# Altium schematic sheet KS-WL-GW-MCU.SchDoc
size A3; CheckedBy: Fanmingjie; Author: Jason Huang; DrawnBy: Chen Minjie; Address1: Buliding 5, No.1528,; Address2: Gu Mei Rd HQ6,; Address3: Shanghai, China; Address4: 200233; Revision: 0.1; SheetNumber: 1; SheetTotal: 1; DocumentName: NGHA SCC V0.1; ProjectName: NGHA
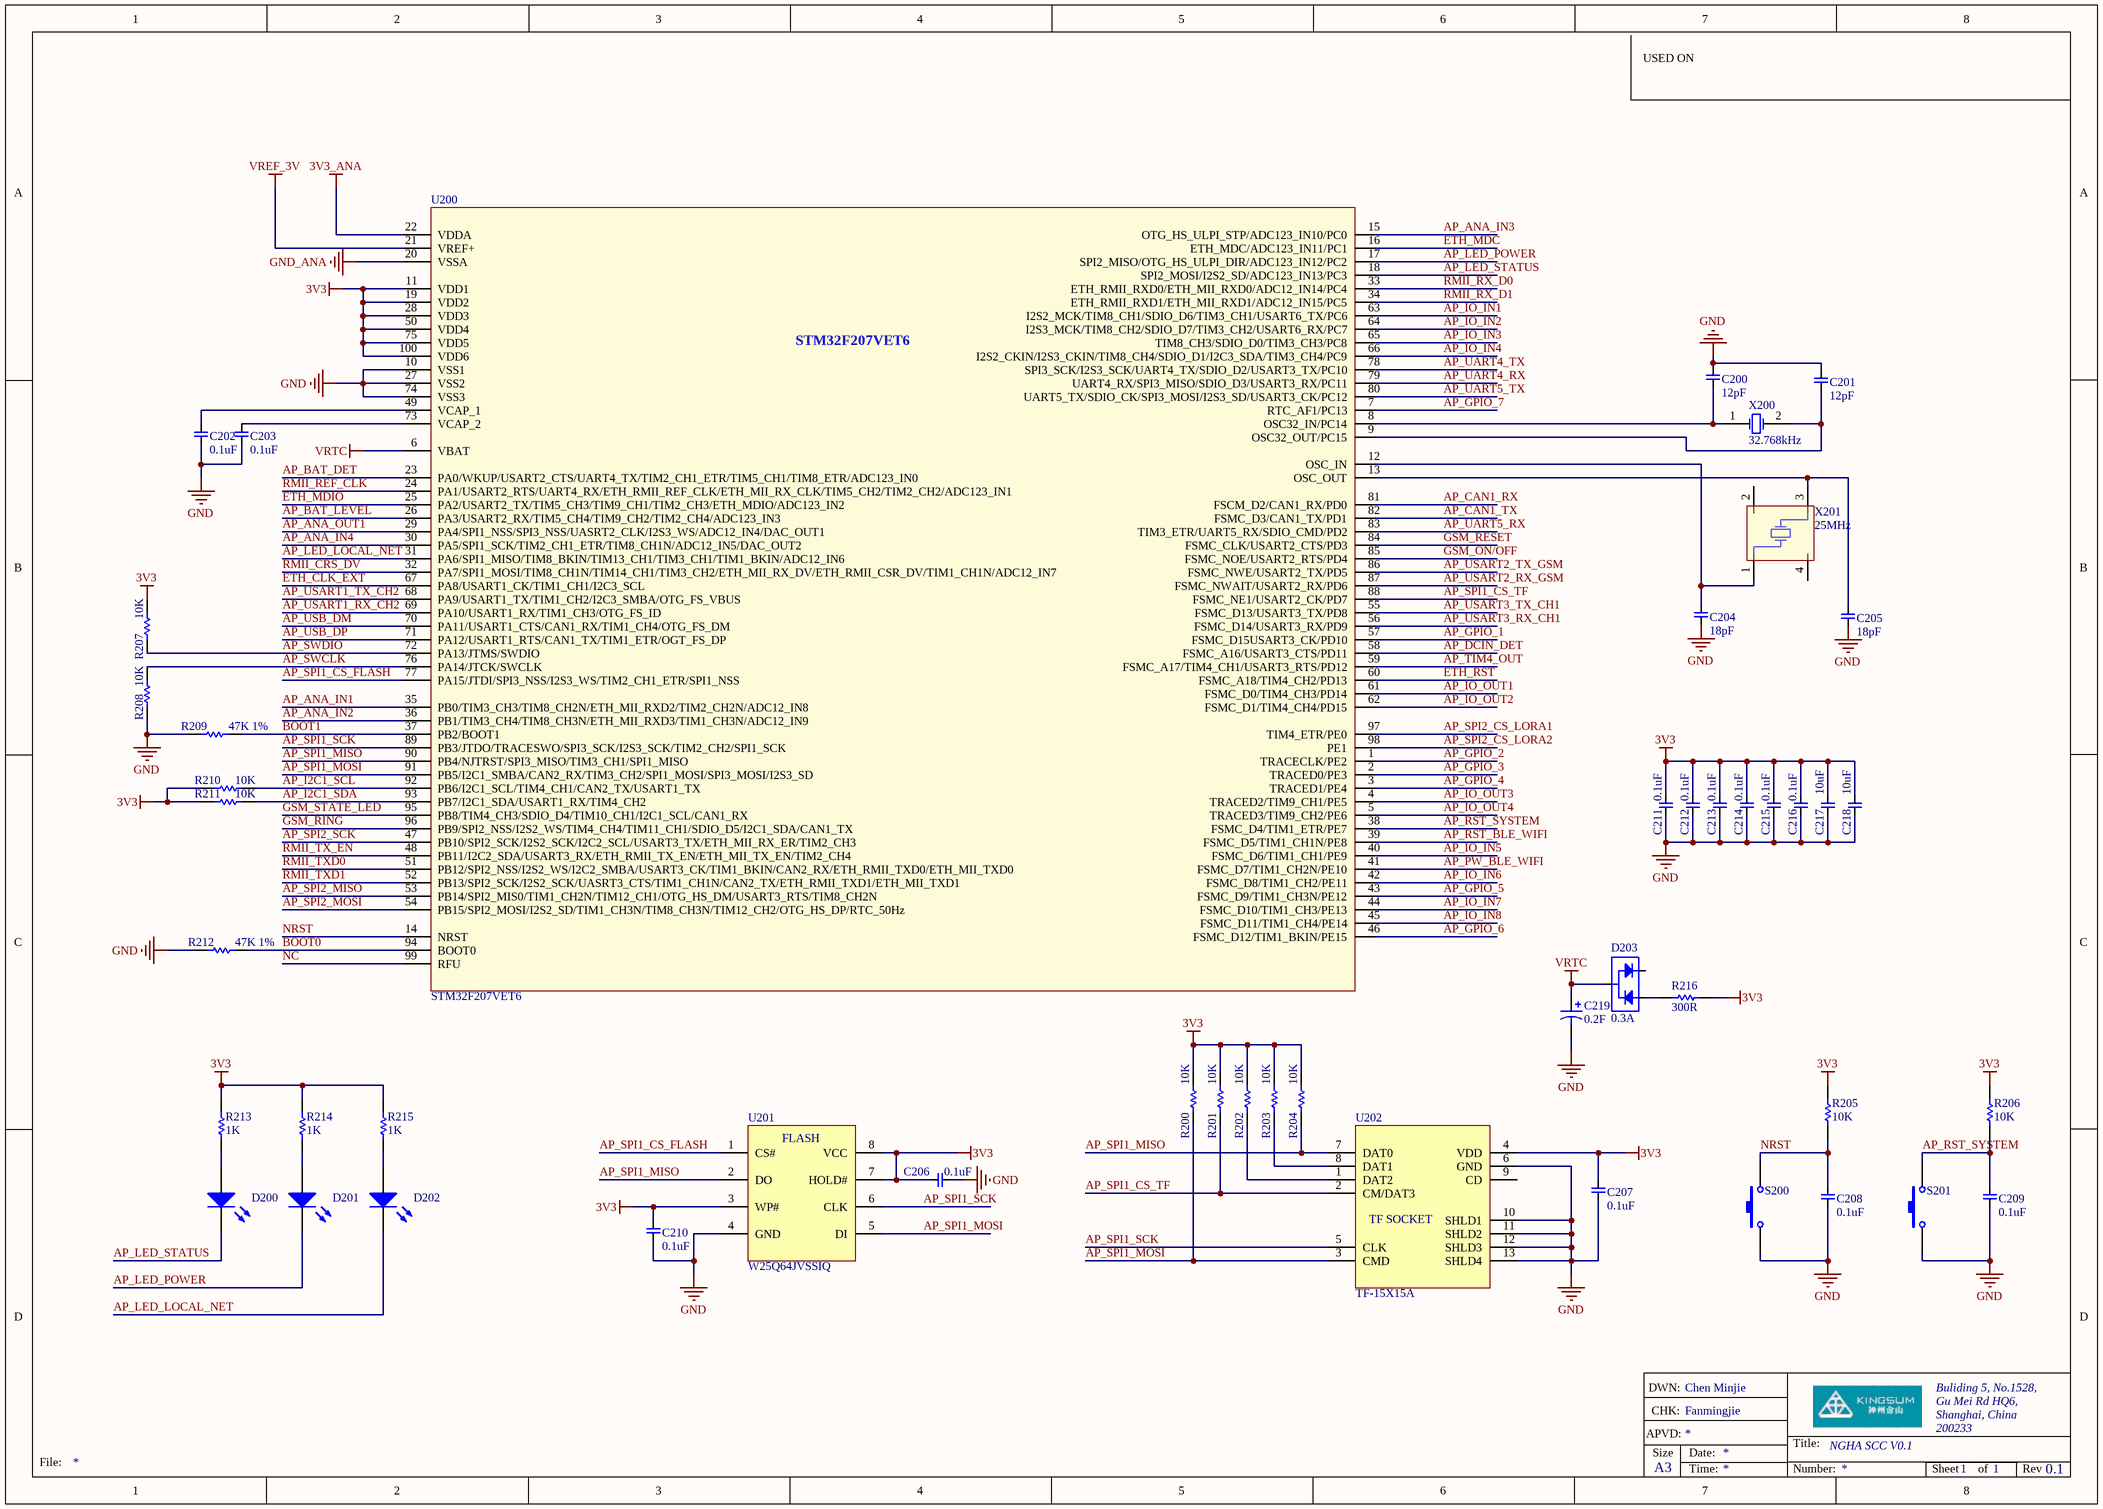
[diagram p0: KS-WL-GW-MCU.SchDoc]

## Parts
C200  12pF  [0402 CAP]
C201  12pF  [0402 CAP]
C202  0.1uF  [0402 CAP]
C203  0.1uF  [0402 CAP]
C204  18pF  [0402 CAP]
C205  18pF  [0402 CAP]
C206  0.1uF  [0402 CAP]
C207  0.1uF  [0402 CAP]
C208  0.1uF  [0402 CAP]
C209  0.1uF  [0402 CAP]
C210  0.1uF  [0402 CAP]
C211  0.1uF  [0402 CAP]
C212  0.1uF  [0402 CAP]
C213  0.1uF  [0402 CAP]
C214  0.1uF  [0402 CAP]
C215  0.1uF  [0402 CAP]
C216  0.1uF  [0402 CAP]
C217  10uF  [C1206_L]
C218  10uF  [C1206_L]
C219  0.2F  [RTC Cap]
D200  GRN  [led 257]  (value not drawn)
D201  GRN  [led 257]  (value not drawn)
D202  GRN  [led 257]  (value not drawn)
D203  0.3A  [SOT-23-3]
R200  10K  [0402 Res]
R201  10K  [0402 Res]
R202  10K  [0402 Res]
R203  10K  [0402 Res]
R204  10K  [0402 Res]
R205  10K  [0402 Res]
R206  10K  [0402 Res]
R207  10K  [0402 Res]
R208  10K  [0402 Res]
R209  47K 1%  [0402 Res]
R210  10K  [0402 Res]
R211  10K  [0402 Res]
R212  47K 1%  [0402 Res]
R213  1K  [0402 Res]
R214  1K  [0402 Res]
R215  1K  [0402 Res]
R216  300R  [0402 Res]
S200  ADE-SW-Button 6X6  [Switch P4 6X6]  (value not drawn)
S201  Kingsum-SW-Button 668  [SW 6X6X8]  (value not drawn)
U200  STM32F207VET6  [LQFP100]
U201  W25Q64JVSSIQ  [SOICW-8]
U202  TF-15X15A  [TF Socket SOFUNG]
X200  32.768kHz  [XTAL]
X201  25MHz  [XTAL_4 - 25X20]

## Nets
3V3: C206.2 C207.1 C210.2 C211.2 C212.2 C213.2 C214.2 C215.2 C216.2 C217.2 C218.2 R200.2 R201.2 R202.2 R203.2 R204.2 R205.2 R206.2 R207.2 R210.1 R211.1 R213.2 R214.2 R215.2 R216.2 U200.11(VDD1) U200.19(VDD2) U200.28(VDD3) U200.50(VDD4) U200.75(VDD5) U200.100(VDD6) U201.3(WP#) U201.7(HOLD#) U201.8(VCC) U202.4(VDD)
3V3_ANA: U200.22(VDDA)
GND: C200.2 C201.2 C202.1 C203.1 C204.1 C205.1 C206.1 C207.2 C208.1 C209.1 C210.1 C211.1 C212.1 C213.1 C214.1 C215.1 C216.1 C217.1 C218.1 C219.2 R208.1 R209.2 R212.2 S200.1 S201.1 U200.10(VSS1) U200.27(VSS2) U200.74(VSS3) U201.4(GND) U202.6(GND) U202.10(SHLD1) U202.11(SHLD2) U202.12(SHLD3) U202.13(SHLD4)
GND_ANA: U200.20(VSSA)
VREF_3V: U200.21(VREF+)
VRTC: C219.1 D203.3 U200.6(VBAT)
AP_ANA_IN1: U200.35(PB0/TIM3_CH3/TIM8_CH2N/ETH_MII_RXD2/TIM2_CH2N/ADC12_IN8)
AP_ANA_IN2: U200.36(PB1/TIM3_CH4/TIM8_CH3N/ETH_MII_RXD3/TIM1_CH3N/ADC12_IN9)
AP_ANA_IN3: U200.15(OTG_HS_ULPI_STP/ADC123_IN10/PC0)
AP_ANA_IN4: U200.30(PA5/SPI1_SCK/TIM2_CH1_ETR/TIM8_CH1N/ADC12_IN5/DAC_OUT2)
AP_ANA_OUT1: U200.29(PA4/SPI1_NSS/SPI3_NSS/UASRT2_CLK/I2S3_WS/ADC12_IN4/DAC_OUT1)
AP_BAT_DET: U200.23(PA0/WKUP/USART2_CTS/UART4_TX/TIM2_CH1_ETR/TIM5_CH1/TIM8_ETR/ADC123_IN0)
AP_BAT_LEVEL: U200.26(PA3/USART2_RX/TIM5_CH4/TIM9_CH2/TIM2_CH4/ADC123_IN3)
AP_CAN1_RX: U200.81(FSCM_D2/CAN1_RX/PD0)
AP_CAN1_TX: U200.82(FSMC_D3/CAN1_TX/PD1)
AP_DCIN_DET: U200.58(FSMC_A16/USART3_CTS/PD11)
AP_GPIO_1: U200.57(FSMC_D15USART3_CK/PD10)
AP_GPIO_2: U200.1(TRACECLK/PE2)
AP_GPIO_3: U200.2(TRACED0/PE3)
AP_GPIO_4: U200.3(TRACED1/PE4)
AP_GPIO_5: U200.43(FSMC_D9/TIM1_CH3N/PE12)
AP_GPIO_6: U200.46(FSMC_D12/TIM1_BKIN/PE15)
AP_GPIO_7: U200.7(RTC_AF1/PC13)
AP_I2C1_SCL: R210.2 U200.92(PB6/I2C1_SCL/TIM4_CH1/CAN2_TX/USART1_TX)
AP_I2C1_SDA: R211.2 U200.93(PB7/I2C1_SDA/USART1_RX/TIM4_CH2)
AP_IO_IN1: U200.63(I2S2_MCK/TIM8_CH1/SDIO_D6/TIM3_CH1/USART6_TX/PC6)
AP_IO_IN2: U200.64(I2S3_MCK/TIM8_CH2/SDIO_D7/TIM3_CH2/USART6_RX/PC7)
AP_IO_IN3: U200.65(TIM8_CH3/SDIO_D0/TIM3_CH3/PC8)
AP_IO_IN4: U200.66(I2S2_CKIN/I2S3_CKIN/TIM8_CH4/SDIO_D1/I2C3_SDA/TIM3_CH4/PC9)
AP_IO_IN5: U200.40(FSMC_D6/TIM1_CH1/PE9)
AP_IO_IN6: U200.42(FSMC_D8/TIM1_CH2/PE11)
AP_IO_IN7: U200.44(FSMC_D10/TIM1_CH3/PE13)
AP_IO_IN8: U200.45(FSMC_D11/TIM1_CH4/PE14)
AP_IO_OUT1: U200.61(FSMC_D0/TIM4_CH3/PD14)
AP_IO_OUT2: U200.62(FSMC_D1/TIM4_CH4/PD15)
AP_IO_OUT3: U200.4(TRACED2/TIM9_CH1/PE5)
AP_IO_OUT4: U200.5(TRACED3/TIM9_CH2/PE6)
AP_LED_LOCAL_NET: D202.2 U200.31(PA6/SPI1_MISO/TIM8_BKIN/TIM13_CH1/TIM3_CH1/TIM1_BKIN/ADC12_IN6)
AP_LED_POWER: D201.2 U200.17(SPI2_MISO/OTG_HS_ULPI_DIR/ADC123_IN12/PC2)
AP_LED_STATUS: D200.2 U200.18(SPI2_MOSI/I2S2_SD/ADC123_IN13/PC3)
AP_PW_BLE_WIFI: U200.41(FSMC_D7/TIM1_CH2N/PE10)
AP_RST_BLE_WIFI: U200.39(FSMC_D5/TIM1_CH1N/PE8)
AP_RST_SYSTEM: C209.2 R206.1 S201.2 U200.38(FSMC_D4/TIM1_ETR/PE7)
AP_SPI1_CS_FLASH: U200.77(PA15/JTDI/SPI3_NSS/I2S3_WS/TIM2_CH1_ETR/SPI1_NSS) U201.1(CS#)
AP_SPI1_CS_TF: R201.1 U200.88(FSMC_NE1/USART2_CK/PD7) U202.2(CM/DAT3)
AP_SPI1_MISO: R204.1 U200.90(PB4/NJTRST/SPI3_MISO/TIM3_CH1/SPI1_MISO) U201.2(DO) U202.7(DAT0)
AP_SPI1_MOSI: R200.1 U200.91(PB5/I2C1_SMBA/CAN2_RX/TIM3_CH2/SPI1_MOSI/SPI3_MOSI/I2S3_SD) U201.5(DI) U202.3(CMD)
AP_SPI1_SCK: U200.89(PB3/JTDO/TRACESWO/SPI3_SCK/I2S3_SCK/TIM2_CH2/SPI1_SCK) U201.6(CLK) U202.5(CLK)
AP_SPI2_CS_LORA1: U200.97(TIM4_ETR/PE0)
AP_SPI2_CS_LORA2: U200.98(PE1)
AP_SPI2_MISO: U200.53(PB14/SPI2_MIS0/TIM1_CH2N/TIM12_CH1/OTG_HS_DM/USART3_RTS/TIM8_CH2N)
AP_SPI2_MOSI: U200.54(PB15/SPI2_MOSI/I2S2_SD/TIM1_CH3N/TIM8_CH3N/TIM12_CH2/OTG_HS_DP/RTC_50Hz)
AP_SPI2_SCK: U200.47(PB10/SPI2_SCK/I2S2_SCK/I2C2_SCL/USART3_TX/ETH_MII_RX_ER/TIM2_CH3)
AP_SWCLK: R208.2 U200.76(PA14/JTCK/SWCLK)
AP_SWDIO: R207.1 U200.72(PA13/JTMS/SWDIO)
AP_TIM4_OUT: U200.59(FSMC_A17/TIM4_CH1/USART3_RTS/PD12)
AP_UART4_RX: U200.79(UART4_RX/SPI3_MISO/SDIO_D3/USART3_RX/PC11)
AP_UART4_TX: U200.78(SPI3_SCK/I2S3_SCK/UART4_TX/SDIO_D2/USART3_TX/PC10)
AP_UART5_RX: U200.83(TIM3_ETR/UART5_RX/SDIO_CMD/PD2)
AP_UART5_TX: U200.80(UART5_TX/SDIO_CK/SPI3_MOSI/I2S3_SD/USART3_CK/PC12)
AP_USART1_RX_CH2: U200.69(PA10/USART1_RX/TIM1_CH3/OTG_FS_ID)
AP_USART1_TX_CH2: U200.68(PA9/USART1_TX/TIM1_CH2/I2C3_SMBA/OTG_FS_VBUS)
AP_USART2_RX_GSM: U200.87(FSMC_NWAIT/USART2_RX/PD6)
AP_USART2_TX_GSM: U200.86(FSMC_NWE/USART2_TX/PD5)
AP_USART3_RX_CH1: U200.56(FSMC_D14/USART3_RX/PD9)
AP_USART3_TX_CH1: U200.55(FSMC_D13/USART3_TX/PD8)
AP_USB_DM: U200.70(PA11/USART1_CTS/CAN1_RX/TIM1_CH4/OTG_FS_DM)
AP_USB_DP: U200.71(PA12/USART1_RTS/CAN1_TX/TIM1_ETR/OGT_FS_DP)
BOOT0: R212.1 U200.94(BOOT0)
BOOT1: R209.1 U200.37(PB2/BOOT1)
ETH_CLK_EXT: U200.67(PA8/USART1_CK/TIM1_CH1/I2C3_SCL)
ETH_MDC: U200.16(ETH_MDC/ADC123_IN11/PC1)
ETH_MDIO: U200.25(PA2/USART2_TX/TIM5_CH3/TIM9_CH1/TIM2_CH3/ETH_MDIO/ADC123_IN2)
ETH_RST: U200.60(FSMC_A18/TIM4_CH2/PD13)
GSM_ON/OFF: U200.85(FSMC_NOE/USART2_RTS/PD4)
GSM_RESET: U200.84(FSMC_CLK/USART2_CTS/PD3)
GSM_RING: U200.96(PB9/SPI2_NSS/I2S2_WS/TIM4_CH4/TIM11_CH1/SDIO_D5/I2C1_SDA/CAN1_TX)
GSM_STATE_LED: U200.95(PB8/TIM4_CH3/SDIO_D4/TIM10_CH1/I2C1_SCL/CAN1_RX)
NC: U200.99(RFU)
NRST: C208.2 R205.1 S200.2 U200.14(NRST)
RMII_CRS_DV: U200.32(PA7/SPI1_MOSI/TIM8_CH1N/TIM14_CH1/TIM3_CH2/ETH_MII_RX_DV/ETH_RMII_CSR_DV/TIM1_CH1N/ADC12_IN7)
RMII_REF_CLK: U200.24(PA1/USART2_RTS/UART4_RX/ETH_RMII_REF_CLK/ETH_MII_RX_CLK/TIM5_CH2/TIM2_CH2/ADC123_IN1)
RMII_RX_D0: U200.33(ETH_RMII_RXD0/ETH_MII_RXD0/ADC12_IN14/PC4)
RMII_RX_D1: U200.34(ETH_RMII_RXD1/ETH_MII_RXD1/ADC12_IN15/PC5)
RMII_TX_EN: U200.48(PB11/I2C2_SDA/USART3_RX/ETH_RMII_TX_EN/ETH_MII_TX_EN/TIM2_CH4)
RMII_TXD0: U200.51(PB12/SPI2_NSS/I2S2_WS/I2C2_SMBA/USART3_CK/TIM1_BKIN/CAN2_RX/ETH_RMII_TXD0/ETH_MII_TXD0)
RMII_TXD1: U200.52(PB13/SPI2_SCK/I2S2_SCK/UASRT3_CTS/TIM1_CH1N/CAN2_TX/ETH_RMII_TXD1/ETH_MII_TXD1)
NetC200_1: C200.1 U200.8(OSC32_IN/PC14) X200.1(OSC1)
NetC201_1: C201.1 U200.9(OSC32_OUT/PC15) X200.2(OSC2)
NetC202_2: C202.2 U200.49(VCAP_1)
NetC203_2: C203.2 U200.73(VCAP_2)
NetC204_2: C204.2 U200.12(OSC_IN) X201.1(OSC1)
NetC205_2: C205.2 U200.13(OSC_OUT) X201.3(OSC3)
NetD200_1: D200.1 R213.1
NetD201_1: D201.1 R214.1
NetD202_1: D202.1 R215.1
NetD203_1: D203.1 R216.1
NetR202_1: R202.1 U202.1(DAT2)
NetR203_1: R203.1 U202.8(DAT1)

Not connected (* = marked no-connect by the designer): D203 2; U202 9(CD); X201 2(OSC2) 4(OSC4)

## Notes on the sheet
- USED ON
- DWN:
- APVD:
- CHK:
- Size
- Date:
- Title:
- File:
- A3
- Time:
- Number:
- Sheet
- of
- Rev
- (in symbol Kingsum-Flash-W25Q64JVSSIQ) FLASH

## Library data of the parts
C200 C201 = ADE-C0402-12P: Non-polarised capacitor; Part Rev: V; Part Description: CAPACITOR, CERAMIC CHIP, 0402 CASE, SURFACE MOUNT , 12 pF +/-5% 50 V, C0G; Mfr_PN: GRM1555C1H120JA01; Manufacturer: MURATA; Tolerance: +/-5%; Volt-Rated: 50 V; Signal Integrity: Cap; Option: 0; TE PN: ADE-C0402-12P; Series: MLCC; RoHS Compliant: YES; Value: 12pF; Package: 0402; Footprint: 0402; SPICE model: CAP; Published: 10/14/2016; Publisher: TE Connectivity; LatestRevisionDate: 04/22/2013; LatestRevisionNote: Production; ComponentLink1Description: Datasheet; ComponentLink1URL: http://engineeringportal.tycoelectronics.com/web/engineering/part-inquiry?PartNo=1-20065-7; ComponentLink3Description: Package; ComponentLink3URL: http://www.murata.com/products/catalog/pdf/c02e.pdf; ComponentLink2Description: Web Page; ComponentLink2URL: http://dmtec.tycoelectronics.com/dmtec/servlet/DocumentLookup?type=Production+Drawing&name=20065&format=PDF; Price: *; Stock: *; Stock Position: *
C202 C203 C206-C216 = ADE-C0402-0.1U: Non-polarised capacitor; Part Rev: V; Part Description: CAPACITOR, CERAMIC CHIP, 0402 CASE, SURFACE MOUNT , 0.1 uF +/-20% 25 V, X7R; Mfr_PN: GRM155R61E104KA87; Manufacturer: MURATA; Tolerance: +/-10%; Volt-Rated: 25 V; Signal Integrity: Cap; Option: 0; TE PN: ADE-C0402-0.1U; Series: MLCC; RoHS Compliant: YES; Value: 0.1uF; Package: 0402; Footprint: 0402; SPICE model: CAP; Published: 10/14/2016; Publisher: TE Connectivity; LatestRevisionDate: 04/22/2013; LatestRevisionNote: Production; ComponentLink1Description: Datasheet; ComponentLink1URL: http://engineeringportal.tycoelectronics.com/web/engineering/part-inquiry?PartNo=1-20065-7; ComponentLink3Description: Package; ComponentLink3URL: http://www.murata.com/products/catalog/pdf/c02e.pdf; ComponentLink2Description: Web Page; ComponentLink2URL: http://dmtec.tycoelectronics.com/dmtec/servlet/DocumentLookup?type=Production+Drawing&name=20065&format=PDF; Manufacturer2: Yageo; Mfr_PN2: CC0402KRX7R8BB104
C204 C205 = ADE-C0402-18P: Non-polarised capacitor; Part Rev: V; Part Description: CAPACITOR, CERAMIC CHIP, 0402 CASE, SURFACE MOUNT , 18 pF +/-5% 50 V, C0G; Mfr_PN: GRM1555C1H180JA01; Manufacturer: MURATA; Tolerance: +/-5%; Volt-Rated: 50 V; Signal Integrity: Cap; Option: 0; TE PN: ADE-C0402-18P; Series: MLCC; RoHS Compliant: YES; Value: 18pF; Package: 0402; Footprint: 0402; SPICE model: CAP; Published: 10/17/2016; Publisher: TE Connectivity; LatestRevisionDate: 04/22/2013; LatestRevisionNote: Production; ComponentLink1Description: Datasheet; ComponentLink1URL: http://engineeringportal.tycoelectronics.com/web/engineering/part-inquiry?PartNo=1-20065-7; ComponentLink3Description: Package; ComponentLink3URL: http://www.murata.com/products/catalog/pdf/c02e.pdf; ComponentLink2Description: Web Page; ComponentLink2URL: http://dmtec.tycoelectronics.com/dmtec/servlet/DocumentLookup?type=Production+Drawing&name=20065&format=PDF; Stock: *; Stock Position: *
C217 C218 = ADE-C1206-10U: Non-polarised capacitor; Part Rev: V; Part Description: CAPACITOR, CERAMIC CHIP, 1206 CASE, SURFACE MOUNT , 10uF +/-20% 25V, X5R; Mfr_PN: GRM31CR61E106KE15; Manufacturer: MURATA; Tolerance: +/-20%; Volt-Rated: 25V; Signal Integrity: Cap; Option: 0; TE PN: ADE-C1206-10U; Series: MLCC; RoHS Compliant: YES; Value: 10uF; Package: C1206_L; Footprint: C1206; SPICE model: CAP; Published: 10/17/2016; Publisher: TE Connectivity; LatestRevisionDate: 08/05/2013; LatestRevisionNote: Production; ComponentLink1Description: Datasheet; ComponentLink1URL: http://www.murata.com/products/catalog/pdf/c02e.pdf; ComponentLink3Description: Package; ComponentLink2Description: Web Page
C219 = Kingsum-Cap-RTC-C122504: 3V3, 0.2F; Part Rev: V; Manufacturer: STARCAP; Tolerance: +-20%; Volt-Rated: 6V3; Signal Integrity: Cap; Option: 0; Kingsum PN: Kingsum-Cap-RTC-C122504; Series: Electrolytic; Part Description: 3V3, 0.2F; RoHS Compliant: YES; Value: 0.2F; Package: 3528; Footprint: 3528; SPICE model: CAP; Designator: C122504; Published: 10/17/2016; Publisher: TE Connectivity; LatestRevisionNote: Production; ComponentLink1Description: Datasheet; ComponentLink1URL: http://www.rubycon.co.jp/cn/catalog/capacitors.html; Mfr_PN: C122504; ComponentLink3Description: Procurement; ComponentLink3URL: http://www.szlcsc.com/product/details_112141.html; ComponentLink2Description: Web Page
D200-D202 = Kingsum-LED-257: Typical Green GaAs Green; Part Rev: A; Part Description: LED, 2x5x7, 2.28; Mfr_PN: 2A5G3HD01; Manufacturer: Kento; TE_PN: ADE-LED-0402Green; Wavelength: 571nm; Volt-Rated: 2.5 V; Power-Rated: 170mW; Option: 0; ComponentLink2Description: Web Page; Series: SMD LED; ComponentLink3URL: http://www.szlcsc.com/product/details_4051.html; RoHS Compliant: YES; Value: GRN; Package: 0402; Footprint: 0402; SPICE model: Diode; Published: 25/04/2013; Publisher: TE Connectivity; LatestRevisionDate: 27/02/2013; LatestRevisionNote: Production; ComponentLink1Description: Datasheet; ComponentLink3Description: Procurement
D203 = Kingsum-DIODES-BAT54S: SOT-23-3, 30V,200mA, Serial A K; Mfr_PN: BAT54S; Manufacturer: JCST; Power-Rated: 255mW; Option: 0; Tmp Range: -5 to 155; Kingsum_PN: Kingsum-DIODES-BAT54S; Part Rev: A; Series: Diode; Part Description: SOT-23-3, 30V,200mA, Serial A K; ComponentLink3URL: http://www.szlcsc.com/product/details_9087.html; RoHS Compliant: YES; Value: 0.3A; Package: SOT-23-3; Volt-Rated: 30 V; SPICE model: Diode; Published: 24/02/2014; LatestRevisionDate: 27/02/2013; LatestRevisionNote: Production; ComponentLink3Description: Procurement; Price: 0.09
R200-R208 R210 R211 = ADE-R0402-10K: RESISTOR  Normal; Part Rev: A; Part Description: RESISTOR, CHIP, THICK FILM, SURGE CURRENT, 0402 CASE, 1/16 W, 50 V , 10K OHMS +/-5%, +/-100 PPM/DEG C, TIN TERMINATION; Mfr_PN: RC0402JR-7D10KL; Manufacturer: YAGEO; Precision: +/-5%; Volt-Rated: 50 V; Power-Rated: 1/16 W; Signal Integrity: Res; Option: 0; TE_PN: ADE-R0402-10K; ComponentLink2Description: Web Page; ComponentLink2URL: http://dmtec.tycoelectronics.com/dmtec/servlet/DocumentLookup?type=Production+Drawing&name=1900457&format=PDF; Series: General Purpose Chip Resistors; ComponentLink3URL: http://www.yageo.com/documents/recent/PYu-RC0402_51_RoHS_L_6_r.pdf; RoHS Compliant: YES; Value: 10K; Package: 0402; Footprint: kOA1E-0402; SPICE model: RESISTOR; Published: 25/04/2013; Publisher: TE Connectivity; LatestRevisionDate: 25/04/2013; LatestRevisionNote: Production; ComponentLink1URL: http://engineeringportal.tycoelectronics.com/web/engineering/part-inquiry?PartNo=1900457-1; ComponentLink1Description: Datasheet; ComponentLink3Description: Package
R209 R212 = ADE-R0402-47K-1%: RESISTOR  Normal; Part Rev: A; Part Description: RESISTOR, CHIP, THICK FILM, SURGE CURRENT, 0402 CASE, 1/16 W, 50 V , 20K OHMS +/-5%, +/-100 PPM/DEG C, TIN TERMINATION; Mfr_PN: RC0402FR-7D47KL; Manufacturer: YAGEO; TE_PN: ADE-R0402-20K; Precision: +/-1%; Volt-Rated: 50 V; Power-Rated: 1/16 W; Signal Integrity: Res; Option: 0; ComponentLink2Description: Web Page; ComponentLink2URL: http://dmtec.tycoelectronics.com/dmtec/servlet/DocumentLookup?type=Production+Drawing&name=1900457&format=PDF; Series: General Purpose Chip Resistors; ComponentLink3URL: http://www.yageo.com/documents/recent/PYu-RC0402_51_RoHS_L_6_r.pdf; RoHS Compliant: YES; Value: 47K 1%; Package: 0402; Footprint: kOA1E-0402; SPICE model: RESISTOR; Designator: RC0402FR-7D47KL; Published: 25/04/2013; Publisher: TE Connectivity; LatestRevisionDate: 25/04/2013; LatestRevisionNote: Production; ComponentLink1URL: http://engineeringportal.tycoelectronics.com/web/engineering/part-inquiry?PartNo=1900457-1; ComponentLink1Description: Datasheet; ComponentLink3Description: Package
R213-R215 = ADE-R0402-1K: RESISTOR  Normal; Part Rev: A; Part Description: RESISTOR, CHIP, THICK FILM, SURGE CURRENT, 0402 CASE, 1/16 W, 50 V , 1K OHMS +/-5%, +/-100 PPM/DEG C, TIN TERMINATION; Mfr_PN: RC0402JR-7D1KL; Manufacturer: YAGEO; Precision: +/-5%; Volt-Rated: 50 V; Power-Rated: 1/16 W; Signal Integrity: Res; Option: 0; TE_PN: ADE-R0402-1K; ComponentLink2Description: Web Page; ComponentLink2URL: http://dmtec.tycoelectronics.com/dmtec/servlet/DocumentLookup?type=Production+Drawing&name=1900457&format=PDF; Series: General Purpose Chip Resistors; ComponentLink3URL: http://www.yageo.com/documents/recent/PYu-RC0402_51_RoHS_L_6_r.pdf; RoHS Compliant: YES; Value: 1K; Package: 0402; Footprint: kOA1E-0402; SPICE model: RESISTOR; Designator: RC0402JR-7D1KL; Published: 25/04/2013; Publisher: TE Connectivity; LatestRevisionDate: 11/15/2012; LatestRevisionNote: Production; ComponentLink1URL: http://engineeringportal.tycoelectronics.com/web/engineering/part-inquiry?PartNo=1900457-1; ComponentLink1Description: Datasheet; ComponentLink3Description: Package
R216 = ADE-R0402-300R: RESISTOR  Normal; Part Rev: A; Part Description: RESISTOR, CHIP, THICK FILM, SURGE CURRENT, 0402 CASE, 1/16 W, 50 V , 150R OHMS +/-5%, +/-100 PPM/DEG C, TIN TERMINATION; Mfr_PN: RC0402JR-7D300RL; Manufacturer: YAGEO; Precision: +/-5%; Volt-Rated: 50 V; Power-Rated: 1/16 W; Signal Integrity: Res; Option: 0; TE_PN: ADE-R0402-300R; ComponentLink2Description: Web Page; ComponentLink2URL: http://dmtec.tycoelectronics.com/dmtec/servlet/DocumentLookup?type=Production+Drawing&name=1900457&format=PDF; Series: General Purpose Chip Resistors; ComponentLink3URL: http://www.yageo.com/documents/recent/PYu-RC0402_51_RoHS_L_6_r.pdf; RoHS Compliant: YES; Value: 300R; Package: 0402; Footprint: kOA1E-0402; SPICE model: RESISTOR; Designator: RC0402JR-7D300RL; Published: 25/04/2013; Publisher: TE Connectivity; LatestRevisionDate: 25/04/2013; LatestRevisionNote: Production; ComponentLink1URL: http://engineeringportal.tycoelectronics.com/web/engineering/part-inquiry?PartNo=1900457-1; ComponentLink1Description: Datasheet; ComponentLink3Description: Package
S200 = ADE-SW-Button 6X6: Switch, butten 6X6, 4 position; Part Description: button 6X6,4pin, https://detail.tmall.com/item.htm?spm=a1z10.3-b.w4011-8679163093.53.EMnPn4&id=536551817827&rn=ee0ff7ea2e2bc9ea889df9de6a9247ba&abbucket=2; Option: 0; Published: 24-Mar-1999; LatestRevisionDate: 17-Jul-2002; LatestRevisionNote: Re-released for DXP Platform.; PackageReference: SW-3X6X2.5H; Publisher: TE Connectivity; PackageDescription: Switch; 2 Leads; ComponentLink2Description: Web Page; ComponentLink1Description: Z:\HW Lib\Altium Lib\Altium ECL\Datasheet\switch\Button 6X6.jpg; ComponentLink3Description: https://detail.tmall.com/item.htm?spm=a1z10.3-b.w4011-8679163093.53.EMnPn4&id=536551817827&rn=ee0ff7ea2e2bc9ea889df9de6a9247ba&abbucket=2
S201 = Kingsum-SW-Button 668: Switch 6x6x8, Right angle; Manufacturer1: BBJ; Option: 0; Published: 24-Mar-1999; LatestRevisionDate: 17-Jul-2002; LatestRevisionNote: Re-released for DXP Platform.; PackageReference: SW-6X6X8H; Publisher: TE Connectivity; PackageDescription: Switch; 2 Leads; ComponentLink2Description: Web Page; ComponentLink1Description: Datasheet; ComponentLink3Description: Procurement; ComponentLink3URL: http://www.szlcsc.com/product/details_72941.html; Kingsum PN: Kingsum-SW-Button 668; Mfr_PN1: 6X6X8
U200 = Kingsum-MCU-STM32F207VET6: ARM M3, 100pinLQFP, ST Semiconductor; Part Rev: REV. 6; Option: 0; Tmp Range: -40 to 85; FirstPublished: *; DatasheetVersion: REV. 6; Publisher: TE; Supplier 1: ST; Supplier Part Number 1: STM32F207VET6; ComponentLink1Description: Datasheet; ComponentLink1URL: Datasheet/mcu; ComponentLink3Description: Procurement; ComponentLink3URL: http://www.szlcsc.com/product/details_60172.html; Code_IPC: *; Code_JEITA: *; Footprint: LQFP 100; LatestRevisionDate: 2014/2; LatestRevisionNote: PRODUCTION; Mfr_PN: STM32F207VET6; Package: LQFP 100; Part Description: ARM M3, 100pinLQFP, ST Semiconductor; Published: 2015/09/18; RoHS Compliant: YES; Series: STM32F; Kingsum PN: Kingsum-MCU-STM32F207VET6; Manufacturer: ST
U201 = Kingsum-Flash-W25Q64JVSSIQ: 3V 64MBIT SERIAL FLASH MEMORY WITH DUAL/QUAD SPI; Manufacturer: WINBOND; Option: 0; Tmp Range: -40 to 85; Publisher: FMJ; ComponentLink1Description: Datasheet; ComponentLink1URL: Datasheet/Flash; ComponentLink2Description: Web Page; ComponentLink3Description: Procurement; ComponentLink3URL: http://www.szlcsc.com/product/details_84304.html; Code_IPC: *; Code_JEITA: *; Footprint: SOP8; LatestRevisionNote: PRODUCTION; Mfr_PN: W25Q64JVSSIQ; Package: SOP8; Part Rev: *; Published: 10/14/2016; RoHS Compliant: YES; Kingsum PN: Kingsum-Flash-W25Q64JVSSIQ; Part Description: 3V 64MBIT SERIAL FLASH MEMORY WITH DUAL/QUAD SPI; Price: 3.6; Stock: *; Stock Position: *
U202 = kingsum-Socket-TF: TF SOCKET; Manufacturer: SOFNG; Option: 0; Publisher: FMJ; ComponentLink1Description: Datasheet; ComponentLink1URL: Datasheet/SOCKET; ComponentLink2Description: Web Page; ComponentLink3Description: Procurement; ComponentLink3URL: http://www.szlcsc.com/product/details_112422.html; Code_IPC: *; Code_JEITA: *; Footprint: SO8; LatestRevisionNote: PRODUCTION; Mfr_PN: TF-15X15A; Part Rev: *; Published: 10/14/2016; RoHS Compliant: YES; Kingsum PN: kingsum-Socket-TF; Part Description: TF SOCKET; Price: 1; Stock: *; Stock Position: *
X200 = ADE-XTAL-32.768-6pF: XTAL, 32.768kHZ; Part Rev: V; Part Description: Cystal Oscillator,STD-MUA-14, 32.768kHZ, SMD, 6pF; Mfr_PN: NX3215SA-STD-MUA-14; Manufacturer: NDK; Tolerance: ±20ppm; Volt-Rated: 50 V; Option: 0; Series: MLCC; RoHS Compliant: YES; Value: 32.768kHz; Package: XTAL; Footprint: 0402; SPICE model: XTAL; Signal Integrity: XTAL; Published: 31/03/2014; Publisher: TE Connectivity; LatestRevisionDate: 04/22/2013; LatestRevisionNote: Production; ComponentLink1Description: Datasheet; ComponentLink1URL: http://www.ndk.com/cn/products/search/crystal/nx3215sa.html; ComponentLink3Description: Package; ComponentLink2Description: Web Page
X201 = Kingsum-XTAL-XXCCCLNANF-25M: XTAL, 25M 10pF 100ppm; Part Description: Cystal Oscillator, NX2520SA , 32MHZ, SMD, 15pF; Manufacturer: TACT; Tolerance: ±20ppm; Option: 0; Tmp Range: -40 to 85; Kingsum PN: Kingsum-XTAL-XXCCCLNANF-25M; RoHS Compliant: YES; Value: 25MHz; Package: 2520; Footprint: XTAL_4; SPICE model: XTAL; Signal Integrity: XTAL; Published: 05/02/2015; LatestRevisionDate: 05/02/2015; LatestRevisionNote: Production; ComponentLink1URL: http://www.ndk.com/images/products/catalog/c_NX2520SA_e.pdf; Mfr_PN: XXCCCLNANF-25M; ComponentLink3Description: Procurement; ComponentLink3URL: http://www.szlcsc.com/product/details_119135.html; ComponentLink2Description: Web Page